# EAGLE design board (EAGLE 9.6.2)
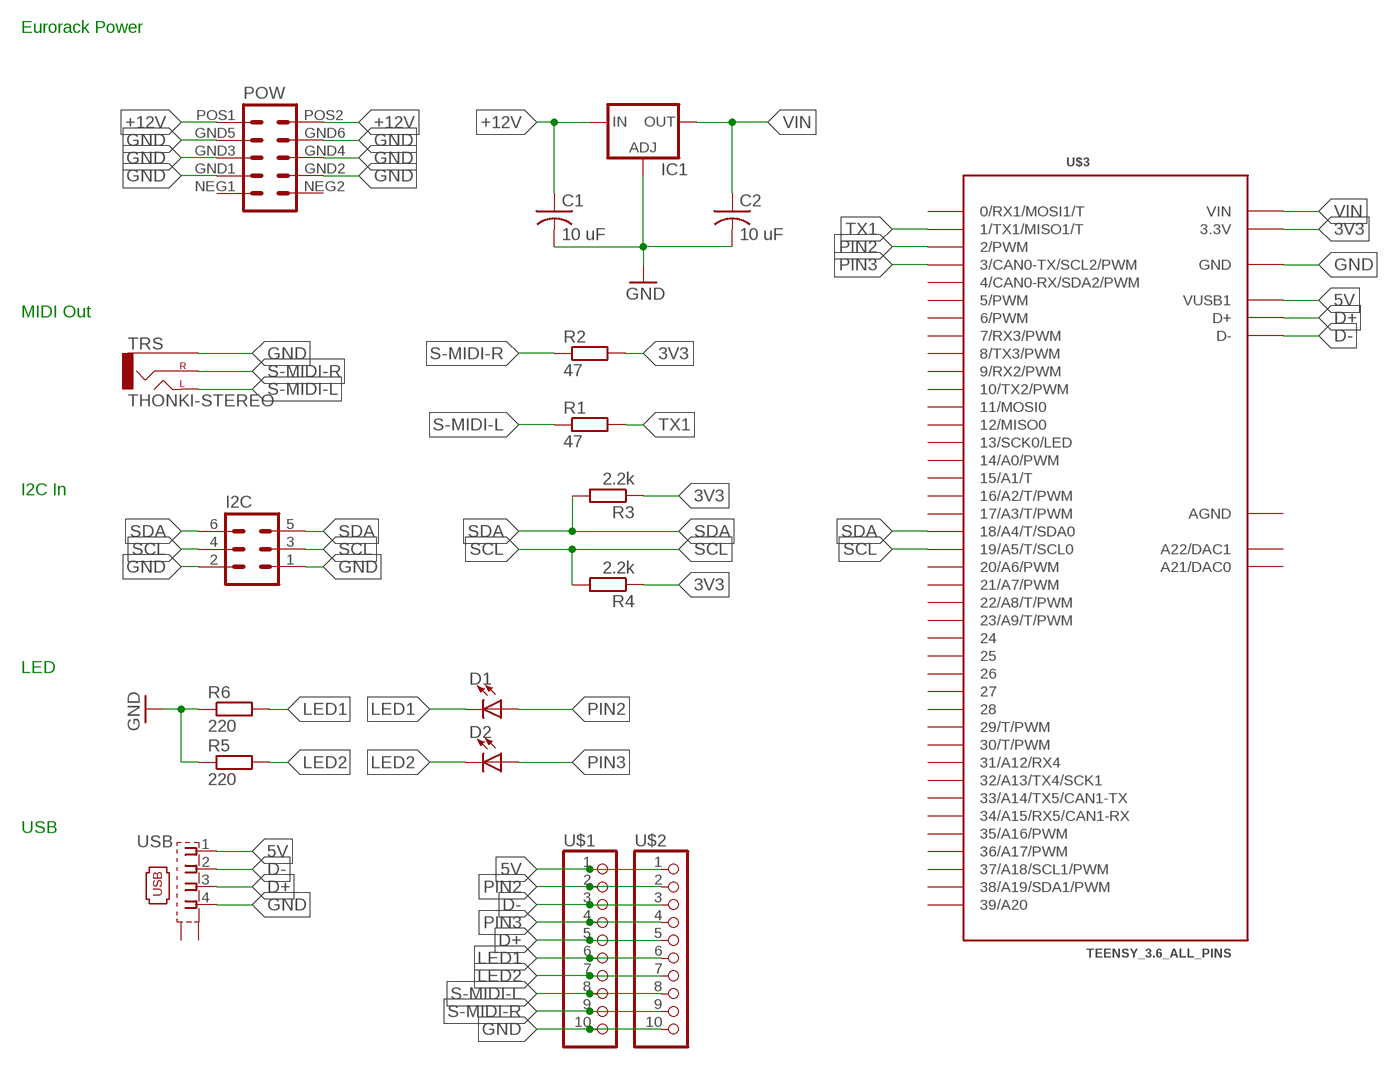
[diagram p0: schematic, sheet 1]

## Parts
C1  10 uF  C-US050-025X075  [C050-025X075]
C2  10 uF  C-US050-025X075  [C050-025X075]
D1  LED3MM  [LED3MM]
D2  LED3MM  [LED3MM]
I2C  MA03-2BACKSIDEFRONTSIDE  [MA03-2]
IC1  LD117AS50TR  [SOT223]
POW  EURO_POWER_HEADERLOCK_PADS  [EURO_PWR_HEADER_LOCK]
R1  47  RESISTOR10MM_RESISTOR  [10MM_RESISTOR]
R2  47  RESISTOR10MM_RESISTOR  [10MM_RESISTOR]
R3  2.2k  RESISTOR10MM_RESISTOR  [10MM_RESISTOR]
R4  2.2k  RESISTOR10MM_RESISTOR  [10MM_RESISTOR]
R5  220  RESISTOR10MM_RESISTOR  [10MM_RESISTOR]
R6  220  RESISTOR10MM_RESISTOR  [10MM_RESISTOR]
TRS  THONKI-STEREO  [WQP-PJ366ST_JACK]
U$1  PINHD-1X10  [1X10-BIG]
U$2  PINHD-1X10  [1X10-BIG]
U$3  TEENSY_3.6_ALL_PINS  [TEENSY_3.6_ALL_PINS]
USB  KUSBVX  [KUSBVX]

## Nets
3V3: R2.2 R3.1 R4.1 U$3.3.3V U$3.3.3V3(3.3V)
5V: U$1.1 U$2.1 U$3.VUSB1 USB.1
+12V: C1.1 IC1.3(IN) POW.POS1 POW.POS2
D+: U$1.5 U$2.5 U$3.D+ USB.3
D-: U$1.3 U$2.3 U$3.D- USB.2
GND: C1.2 C2.2 I2C.1 I2C.2 IC1.1(ADJ) POW.GND1 POW.GND2 POW.GND3 POW.GND4 POW.GND5 POW.GND6 R5.1 R6.1 TRS.P$3_SLEEVE(SLEEVE) U$1.10 U$2.10 U$3.GND U$3.GND1(GND) U$3.GND3(GND) U$3.GND4(GND) USB.4
LED1: D1.K(C) R6.2 U$1.6 U$2.6
LED2: D2.K(C) R5.2 U$1.7 U$2.7
PIN2: D1.A U$1.2 U$2.2 U$3.2(2/PWM)
PIN3: D2.A U$1.4 U$2.4 U$3.3(3/CAN0-TX/SCL2/PWM)
S-MIDI-L: R1.1 TRS.P$1_TIP(LEFT) U$1.8 U$2.8
S-MIDI-R: R2.1 TRS.P$2_SWITCH(RIGHT) U$1.9 U$2.9
SCL: I2C.3 I2C.4 R4.2 U$3.19/A5(19/A5/T/SCL0)
SDA: I2C.5 I2C.6 R3.2 U$3.18/A4(18/A4/T/SDA0)
TX1: R1.2 U$3.1(1/TX1/MISO1/T)
VIN: C2.1 IC1.2(OUT) IC1.4(OUT) U$3.VIN
Unconnected: POW.NEG1 POW.NEG2 U$3.0(0/RX1/MOSI1/T) U$3.4(4/CAN0-RX/SDA2/PWM) U$3.5(5/PWM) U$3.6(6/PWM) U$3.7(7/RX3/PWM) U$3.8(8/TX3/PWM) U$3.9(9/RX2/PWM) U$3.10(10/TX2/PWM) U$3.11(11/MOSI0) U$3.12(12/MISO0) U$3.13(13/SCK0/LED) U$3.14/A0(14/A0/PWM) U$3.15/A1(15/A1/T) U$3.16/A2(16/A2/T/PWM) U$3.17/A3(17/A3/T/PWM) U$3.20/A6(20/A6/PWM) U$3.21/A7(21/A7/PWM) U$3.22/A8(22/A8/T/PWM) U$3.23/A9(23/A9/T/PWM) U$3.24 U$3.25 U$3.26 U$3.27 U$3.28 U$3.29(29/T/PWM) U$3.30(30/T/PWM) U$3.31/A12(31/A12/RX4) U$3.32/A13(32/A13/TX4/SCK1) U$3.33/A14(33/A14/TX5/CAN1-TX) U$3.34/A15(34/A15/RX5/CAN1-RX) U$3.35/A16(35/A16/PWM) U$3.36/A17(36/A17/PWM) U$3.37/A18(37/A18/SCL1/PWM) U$3.38/A19(38/A19/SDA1/PWM) U$3.39/A20 U$3.A21(A21/DAC0) U$3.A22(A22/DAC1) USB.M1(S1) USB.M2(S2)

## Notes on the sheet
- Eurorack Power
- MIDI Out
- I2C In
- LED
- USB

## Power pins joined to a net without a drawn wire
AGND: U$3.AGND

## Library data of the parts
C1 C2 = adafruit_jh1:C-US: CAPACITOR, American symbol
D1 D2 = adafruit_jh1:LED: LED OSRAM: - CHIPLED LG R971, LG N971, LY N971, LG Q971, LY Q971, LO R971, LY R971 LH N974, LH R974 LS Q976, LO Q976, LY Q976 LO Q996 - Hyper CHIPLED LW Q18S LB Q993, LB Q99A, LB R99A - SideLED LS A670, LO A670, LY A670, LG A670, LP A670 LB A673, LV A673, LT A673, LW A673 LH A674 LY A675 LS A676, LA A676, LO A676, LY A676, LW A676 LS A679, LY A679, LG A679 - Hyper Micro SIDELED® LS Y876, LA Y876, LO Y876, LY Y876 LT Y87S - SmartLED LW L88C, LW L88S LB L89C, LB L89S, LG L890 LS L89K, LO L89K, LY L89K LS L896, LA L896, LO L896, LY L896 - TOPLED LS T670, LO T670, LY T670, LG T670, LP T670 LSG T670, LSP T670, LSY T670, LOP T670, LYG T670 LG T671, LOG T671, LSG T671 LB T673, LV T673, LT T673, LW T673 LH T674 LS T676, LA T676, LO T676, LY T676, LB T676, LH T676, LSB T676, LW T676 LB T67C, LV T67C, LT T67C, LS T67K, LO T67K, LY T67K, LW E67C LS E67B, LA E67B, LO E67B, LY E67B, LB E67C, LV E67C, LT E67C LW T67C LS T679, LY T679, LG T679 LS T770, LO T770, LY T770, LG T770, LP T770 LB T773, LV T773, LT T773, LW T773 LH T774 LS E675, LA E675, LY E675, LS T675 LS T776, LA T776, LO T776, LY T776, LB T776 LHGB T686 LT T68C, LB T68C - Hyper Mini TOPLED® LB M676 - Mini TOPLED Santana® LG M470 LS M47K, LO M47K, LY M47K Source: http://www.osram.convergy.de/
I2C = MusicThingModular:MA03-2BACKSIDE: PIN HEADER; OC_FARNELL: unknown; OC_NEWARK: unknown
IC1 = v-reg_jh:LD117A?*: Low drop fixed and adjustable positive voltage regulators 1 A Source: http://www.st.com/stonline/products/literature/ds/7194/ld1117axx.pdf
POW = attowatt:EURO_POWER_HEADER: Power Header 10 pin power header for Eurorack Power Supplies Variants with fatter pads for easier soldering, and the LOCK variant which has 5mil offset pins to hold the component in place before soldering
R1-R6 = MusicThingModular_jh:RESISTOR: Standard resistor, various versions
TRS = MusicThingModular_jh:THONKI-STEREO: 3.5mm socket for Eurorack modular synths
U$1 U$2 = adafruit_jh1:PINHD-1X10: Pin header 1x10 0.1" spacing With round pins
U$3 = Teensy_3_and_LC_Series_Boards_v1.4_jh:TEENSY_3.6_ALL_PINS: All PIN version of the Teensy 3.6.
USB = con-kycon_jh:KUSBVX: Vertical,Top Entry Universal Serial Bus Connector KUSBVX Series Source: KYCON Sibalco USB vertical socket KUSBV.pdf

## Board
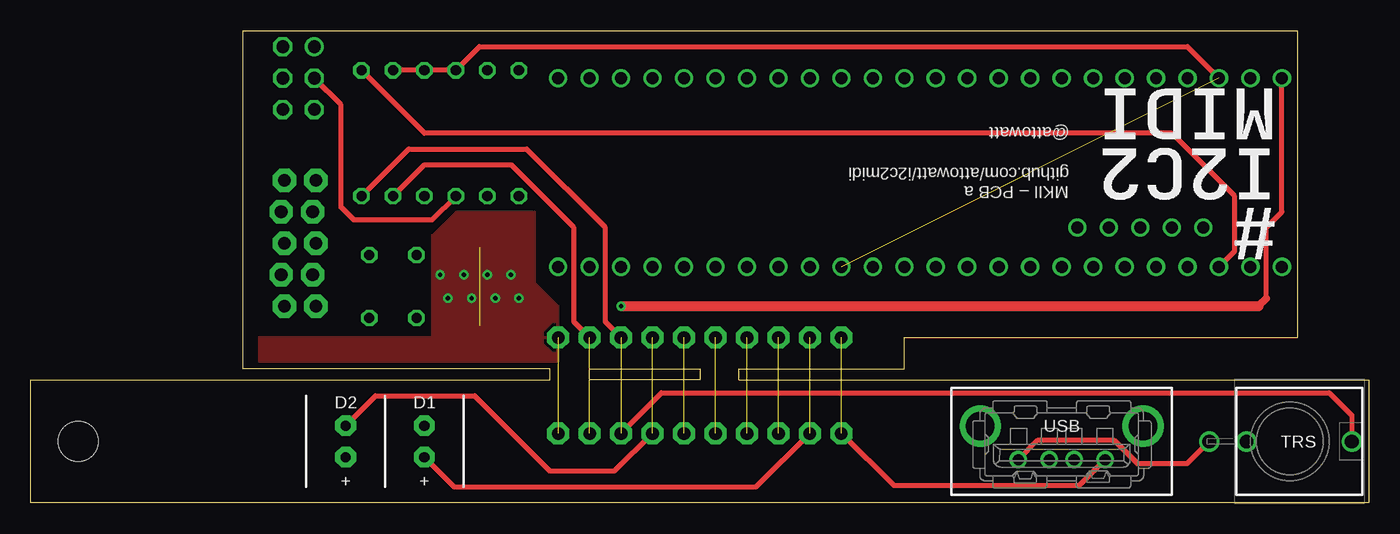
[diagram p1: board, top side]
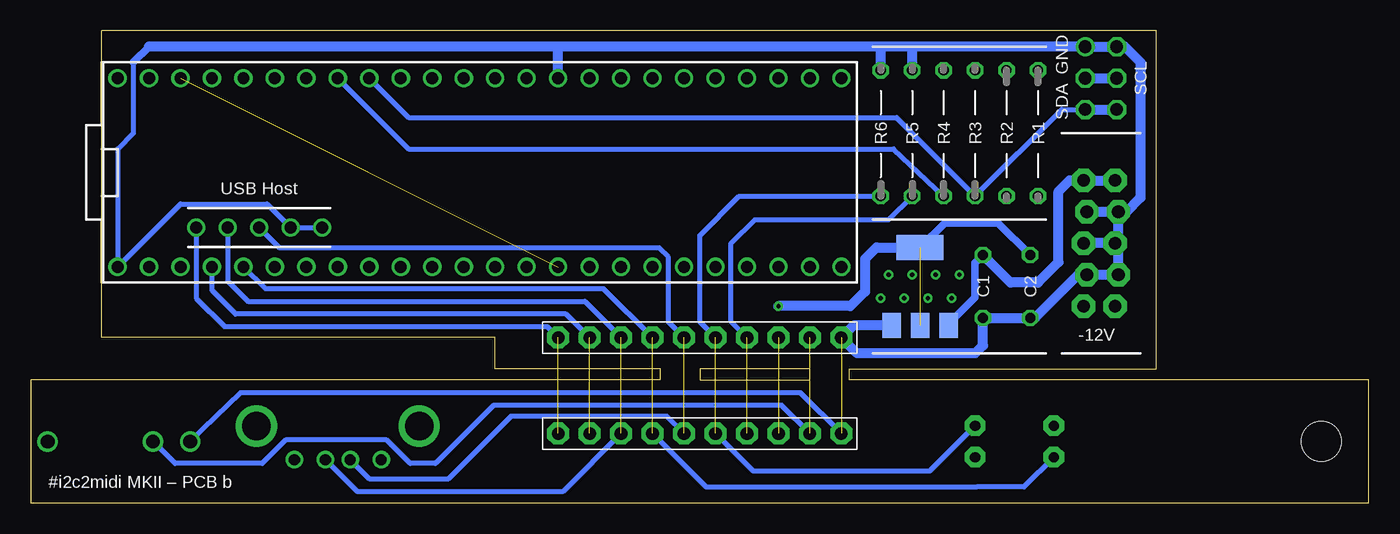
[diagram p2: board, bottom side, seen from below]

Size 107.95 x 38.1 mm. Coordinates in mm from the lower left corner, seen from the top.
Outline: 0,0 0,9.91 41.91,9.91 41.91,10.79 17.14,10.79 17.14,38.1 102.23,38.1 102.23,13.34 70.48,13.34 70.48,10.79 57.15,10.79 57.15,9.91 107.95,9.91 107.95,0 0,0
Outline: 45.09,10.79 53.98,10.79 53.98,9.91 45.09,9.91 45.09,10.79
Copper layers (1*16): Top 0.035mm / dielectric 1.5mm / Bottom 0.035mm
Design rules "default *": minimum track width 6mil, minimum drill 0.35mm, track to track 6mil, track to pad 6mil, pad to pad 6mil, via to via 6mil, smd to smd 6mil, copper to edge 10mil, drill to drill 6mil, minimum pad ring 10mil, minimum via ring 8mil, stop-mask expansion 4mil, vias tented up to drill 0mil, thermal gap 10mil
Holes 3.2 mm at 3.81,4.95

### Footprints (pad centres in the part's own frame; a part is rotated, then mirrored left to right if it is on the bottom)
C050-025X075 = drill 0.813 octagon: 1 -2.54,0; 2 2.54,0
LED3MM = drill 0.813 pad 1.676 octagon: A -1.27,0; K 1.27,0
MA03-2 = drill 1.016: 1 -2.54,-1.27 | drill 1.016 octagon: 2 -2.54,1.27; 3 0,-1.27; 4 0,1.27; 5 2.54,-1.27; 6 2.54,1.27
SOT223 = smd 1.5 x 2: 1 -2.3,-3.15; 2 0,-3.15; 3 2.3,-3.15 | smd 3.8 x 2: 4 0,3.15
EURO_PWR_HEADER_LOCK = drill 1.016 pad 1.88 octagon: GND1 -2.54,1.143; GND2 -2.54,-1.397; GND3 0,1.397; GND4 0,-1.143; GND5 2.54,1.143; GND6 2.54,-1.397; NEG1 -5.08,1.397; NEG2 -5.08,-1.143; POS1 5.08,1.397; POS2 5.08,-1.143
10MM_RESISTOR = drill 0.813 octagon: 1 -5.08,0; 2 5.08,0
WQP-PJ366ST_JACK = drill 1.1: P$1_TIP 0,5; P$2_SWITCH 0,-3.5; P$3_SLEEVE 0,-6.5
1X10-BIG = drill 1.016 pad 1.778 octagon: 1 -11.43,0; 2 -8.89,0; 3 -6.35,0; 4 -3.81,0; 5 -1.27,0; 6 1.27,0; 7 3.81,0; 8 6.35,0; 9 8.89,0; 10 11.43,0
TEENSY_3.6_ALL_PINS = drill 0.965: 0 -7.62,25.4; 1 -7.62,22.86; 2 -7.62,20.32; 3 -7.62,17.78; 3.3V 7.62,22.86; 3.3V3 -7.62,-7.62; 4 -7.62,15.24; 5 -7.62,12.7; 6 -7.62,10.16; 7 -7.62,7.62; 8 -7.62,5.08; 9 -7.62,2.54; 10 -7.62,0; 11 -7.62,-2.54; 12 -7.62,-5.08; 13 7.62,-5.08; 14/A0 7.62,-2.54; 15/A1 7.62,0; 16/A2 7.62,2.54; 17/A3 7.62,5.08; 18/A4 7.62,7.62; 19/A5 7.62,10.16; 20/A6 7.62,12.7; 21/A7 7.62,15.24; 22/A8 7.62,17.78; 23/A9 7.62,20.32; 24 -7.62,-10.16; 25 -7.62,-12.7; 26 -7.62,-15.24; 27 -7.62,-17.78; 28 -7.62,-20.32; 29 -7.62,-22.86; 30 -7.62,-25.4; 31/A12 -7.62,-27.94; 32/A13 -7.62,-30.48; 33/A14 7.62,-30.48; 34/A15 7.62,-27.94; 35/A16 7.62,-25.4; 36/A17 7.62,-22.86; 37/A18 7.62,-20.32; 38/A19 7.62,-17.78; 39/A20 7.62,-15.24; A21 7.62,-12.7; A22 7.62,-10.16; AGND 7.62,25.4; D+ -4.445,16.51; D- -4.445,19.05; GND -7.62,27.94; GND1 7.62,-7.62; GND3 -4.445,13.97; GND4 -4.445,11.43; VIN 7.62,27.94; VUSB1 -4.445,21.59
KUSBVX = drill 0.9 pad 1.3: 1 3.5,0; 2 1,0; 3 -1,0; 4 -3.5,0 | drill 2.3 pad 2.8: M1 -6.57,2.71; M2 6.57,2.71

### Placement (x,y rotation side)
C1  31.11,17.46 270 bottom
C2  27.3,17.46 270 bottom
D1  31.75,4.95 90 top
D2  25.4,4.95 90 top
I2C  21.59,34.29 270 bottom
IC1  36.2,17.46 0 bottom
POW  21.59,20.95 90 bottom
R1  26.67,29.84 90 bottom
R2  29.21,29.84 90 bottom
R3  31.75,29.84 270 bottom
R4  34.29,29.84 270 bottom
R5  36.83,29.84 270 bottom
R6  39.37,29.84 270 bottom
TRS  101.6,4.95 270 top
U$1  53.98,13.34 0 bottom
U$2  53.98,5.59 0 bottom
U$3  73.03,26.67 90 bottom
USB  83.19,3.48 0 top

### Tracks (layer width: path | path; a pad name or v marks a point on that pad's centre or on a via)
3V3  (1 unrouted)
  Top 0.406: U$3.3.3V 93.34,36.83 36.2,36.83 R4.1 R3.1 R2.2
5V  (1 unrouted)
  Top 0.406: USB.1 84.6,1.4 69.64,1.4 U$2.1
  Bottom 0.406: U$3.VUSB1 94.61,16.51 92.33,14.22 66.29,14.22 U$1.1
+12V
  Bottom 0.61: IC1.3 33.9,14.44 31.75,16.58 31.75,19.37 C1.1
  Bottom 0.813: POW.POS2 POW.POS1 24.13,26.04 25.02,25.15 25.02,19.43 26.67,17.78 28.89,17.78 C1.1
D+  (1 unrouted)
  Bottom 0.406: U$3.D+ 87.88,20.57 57.26,20.57 56.52,19.83 56.52,14.61 U$1.5 | USB.3 80.61,1.91 74.3,1.91 69.22,6.99 56.64,6.99 U$2.5
D-  (1 unrouted)
  Bottom 0.406: U$3.D- 92.08,17.91 90.42,16.26 63.25,16.26 U$1.3 | USB.2 81.59,0.89 65.02,0.89 U$2.3
GND  (via drill 0.35)  (1 unrouted)
  Top 0.406: USB.4 81.28,5.08 87.38,5.08 89.28,3.17 93.32,3.17 TRS.P$3_SLEEVE
  Bottom 0.406: TRS.P$3_SLEEVE 95.1,4.97 91.04,8.89 45.85,8.89 U$2.10 | U$3.GND4 U$3.GND3 88.9,24.13 95.89,24.13 U$3.GND 100.97,28.57 99.69,29.84 99.69,35.56
  Bottom 0.61: 98.42,36.83 99.69,35.56
  Bottom 0.813: POW.GND6 19.56,23.5 18.41,24.64 18.41,35.56 19.68,36.83 I2C.2 I2C.1 36.83,36.83 | POW.GND4 20.19,20.7 POW.GND2 POW.GND1 23.43,18.41 26.92,14.92 C2.2 C1.2 31.11,12.7 31.75,12.06 41.27,12.06 U$1.10 41.57,14.31 IC1.1 | POW.GND4 20.19,21.21 POW.GND6 | POW.GND4 POW.GND3 | POW.GND6 POW.GND5 | 36.83,36.83 39.37,36.83 | 39.37,36.83 65.41,36.83 | 65.41,36.83 98.42,36.83 | U$3.GND1 65.41,36.83 | R5.1 36.83,36.83 | R6.1 39.37,36.83
  other vias: 33.02,18.41 33.66,16.51 35.56,16.51 37.47,16.51 39.37,16.51 36.83,18.41 38.73,18.41 34.92,18.41
  pour Top: 40.64,23.5 34.29,23.5 32.38,21.59 32.38,13.34 18.41,13.34 18.41,11.43 42.55,11.43 42.55,15.88 40.64,17.78
LED1  (1 unrouted)
  Bottom 0.406: R6.2 50.8,24.77 53.98,21.59 53.98,14.61 U$1.6 | U$2.6 49.66,2.54 35.43,2.54 D1.K
LED2  (1 unrouted)
  Top 0.406: U$2.7 47.07,2.54 41.91,2.54 35.81,8.64 27.81,8.64 D2.K
  Bottom 0.406: R5.2 38.73,22.86 49.53,22.86 51.44,20.95 51.44,14.61 U$1.7
PIN2  (1 unrouted)
  Top 0.406: U$2.2 58.5,1.27 34.16,1.27 D1.A
  Bottom 0.406: U$3.2 93.34,17.14 91.44,15.24 64.77,15.24 U$1.2
PIN3  (1 unrouted)
  Bottom 0.406: U$1.4 61.72,17.27 89.03,17.27 U$3.3 | U$2.4 53.47,1.27 31.75,1.27 31.62,1.27 27.81,1.27 D2.A
S-MIDI-L  (1 unrouted)
  Top 0.406: TRS.P$1_TIP 106.6,7.07 104.78,8.89 50.88,8.89 U$2.8 | R1.1 30.48,28.57 40.01,28.57 46.35,22.23 46.35,14.61 U$1.8
S-MIDI-R  (1 unrouted)
  Top 0.406: R2.1 31.75,27.3 38.73,27.3 43.81,22.23 43.81,14.61 U$1.9
  Bottom 0.406: TRS.P$2_SWITCH 96.32,3.17 89.28,3.17 87.38,5.08 79.25,5.08 77.34,3.17 75.31,3.17 70.61,7.87 47.37,7.87 U$2.9
SCL
  Top 0.406: I2C.3 25.02,32.13 25.02,23.88 26.04,22.86 32.38,22.86 R4.2
  Bottom 0.406: R4.2 38.34,28.57 77.47,28.57 U$3.19/A5
  Bottom 0.813: I2C.3 I2C.4
SDA
  Bottom 0.406: I2C.5 24.77,31.75 R3.2 38.1,31.11 77.47,31.11 U$3.18/A4
  Bottom 0.813: I2C.5 I2C.6
TX1
  Top 0.406: R1.2 31.75,29.84 92.08,29.84 97.16,24.77 97.16,20.32 U$3.1
VIN  (via drill 0.35)  (1 unrouted)
  Top 0.406: 99.69,16.51 99.69,22.23 100.97,23.5 U$3.VIN
  Top 0.61: 99.06,15.88 99.69,16.51
  Top 0.813: v47.62,15.88 99.06,15.88
  Bottom 0.61: C2.1 29.91,22.61 34.2,22.61 IC1.4
  Bottom 0.813: v47.62,15.88 41.82,15.88 40.64,17.06 40.64,19.68 39.71,20.61 IC1.4

### Text on the board
tPlace: @attowatt | MKII – PCB a / github.com/attowatt/i2c2midi | USB | TRS | + | +
bPlace: GND | SCL | SDA | USB Host | -12V | #i2c2midi MKII – PCB b